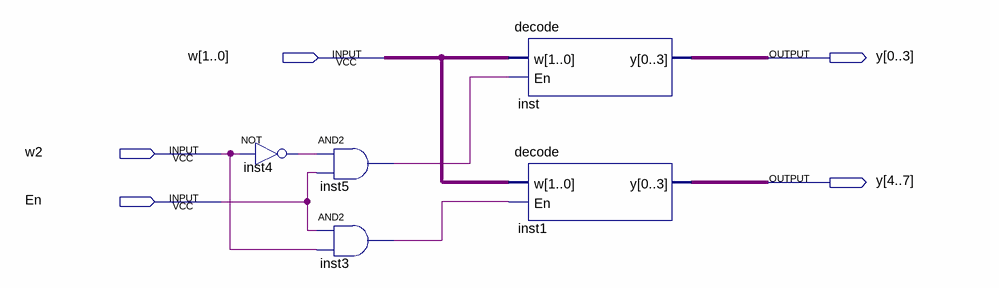
[diagram p0: schematic sheet]
// Quartus schematic decodModified.bdf as structural Verilog: 5 symbols, 5 pins
module decodModified (
  input  [1:0] w,
  input  w2,
  input  En,
  output [0:7] y
);

  wire inst3_out, inst4_out, inst5_out;

  not inst4 (inst4_out, w2);
  and inst5 (inst5_out, inst4_out, En);
  and inst3 (inst3_out, En, w2);
  decode inst (.w(w), .En(inst5_out), .y(y[0:3]));
  decode inst1 (.w(w), .En(inst3_out), .y(y[4:7]));
endmodule
